# EAGLE design TPS_v1 (EAGLE 9.2.2)

## Sheet 1 of 3
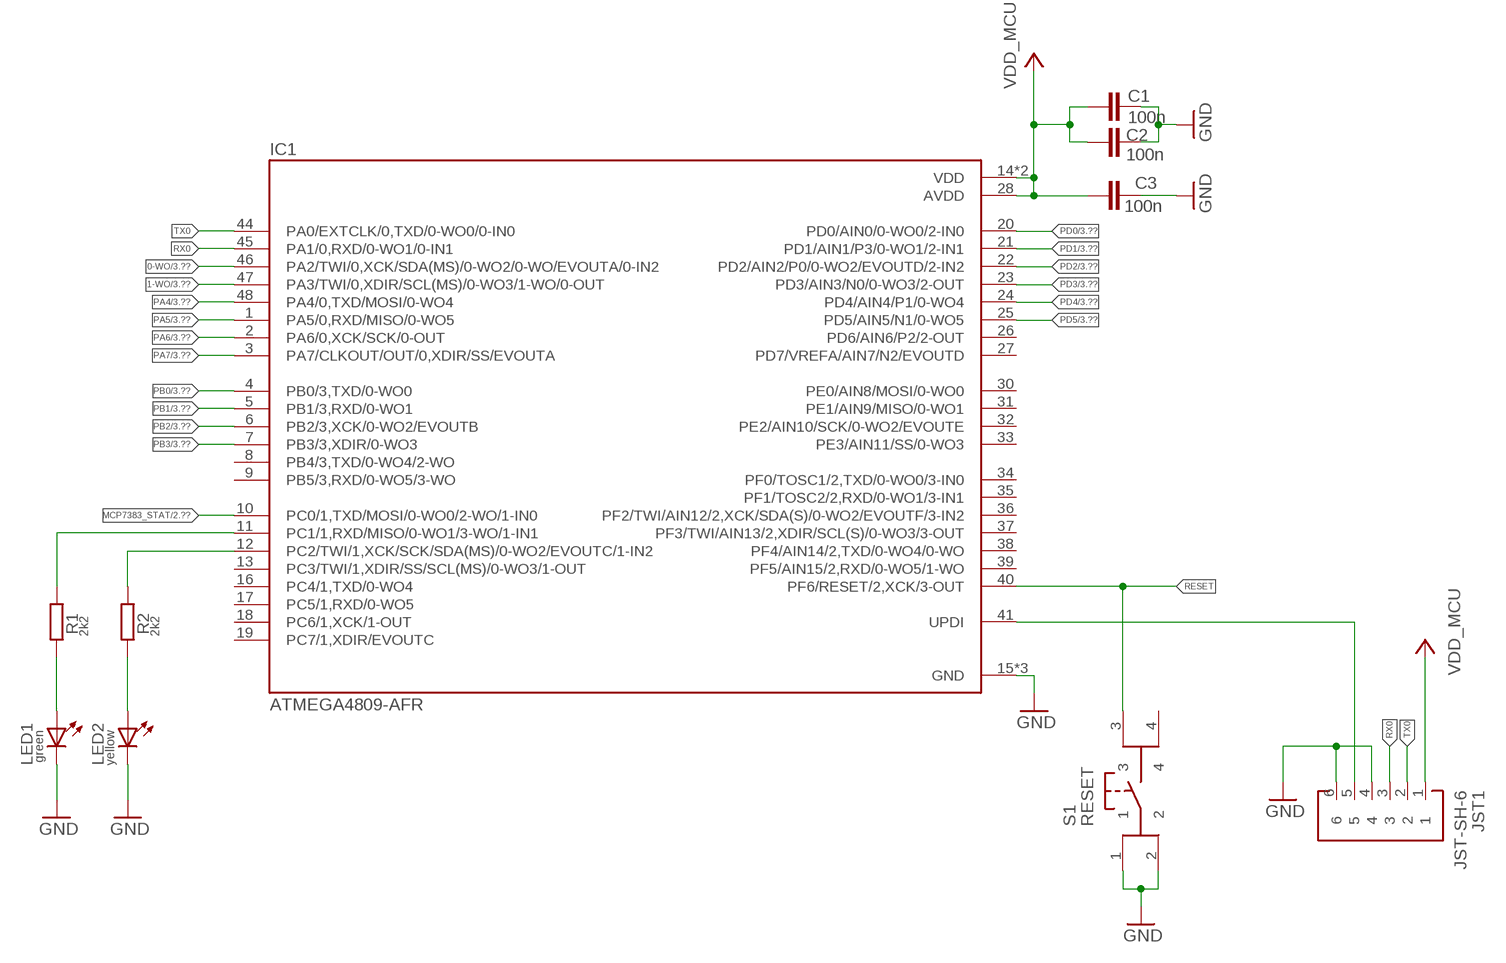
[diagram p0: schematic, sheet 1]

### Parts
C1  100n  CAPACITORC0603  [C0603]
C2  100n  CAPACITORC0603  [C0603]
C3  100n  CAPACITORC0603  [C0603]
IC1  ATMEGA4809-AFR  [QFP50P900X900X120-48N]
JST1  JST-SH-6  [JST-SH-6]
LED1  green  LED0603  [LED_0603]
LED2  yellow  LED0603  [LED_0603]
R1  2k2  RESISTOR  [R0603]
R2  2k2  RESISTOR  [R0603]
S1  RESET  BUTTON  [B3FS-1012]

### Nets
0-WO: IC1.46(PA2/TWI/0,XCK/SDA(MS)/0-WO2/0-WO/EVOUTA/0-IN2) ; also sheet 3
1-WO: IC1.47(PA3/TWI/0,XDIR/SCL(MS)/0-WO3/1-WO/0-OUT) ; also sheet 3
GND: C1.2 C2.2 C3.2 IC1.15(GND) IC1.29(GND) IC1.43(GND) JST1.4 JST1.6 LED1.C LED2.C S1.1 S1.2 ; also sheet 2,3
MCP7383_STAT: IC1.10(PC0/1,TXD/MOSI/0-WO0/2-WO/1-IN0) ; also sheet 2
N$11: LED2.A R2.1
N$13: LED1.A R1.1
N$14: IC1.12(PC2/TWI/1,XCK/SCK/SDA(MS)/0-WO2/EVOUTC/1-IN2) R2.2
N$15: IC1.11(PC1/1,RXD/MISO/0-WO1/3-WO/1-IN1) R1.2
PA4: IC1.48(PA4/0,TXD/MOSI/0-WO4) ; also sheet 3
PA5: IC1.1(PA5/0,RXD/MISO/0-WO5) ; also sheet 3
PA6: IC1.2(PA6/0,XCK/SCK/0-OUT) ; also sheet 3
PA7: IC1.3(PA7/CLKOUT/OUT/0,XDIR/SS/EVOUTA) ; also sheet 3
PB0: IC1.4(PB0/3,TXD/0-WO0) ; also sheet 3
PB1: IC1.5(PB1/3,RXD/0-WO1) ; also sheet 3
PB2: IC1.6(PB2/3,XCK/0-WO2/EVOUTB) ; also sheet 3
PB3: IC1.7(PB3/3,XDIR/0-WO3) ; also sheet 3
PD0: IC1.20(PD0/AIN0/0-WO0/2-IN0) ; also sheet 3
PD1: IC1.21(PD1/AIN1/P3/0-WO1/2-IN1) ; also sheet 3
PD2: IC1.22(PD2/AIN2/P0/0-WO2/EVOUTD/2-IN2) ; also sheet 3
PD3: IC1.23(PD3/AIN3/N0/0-WO3/2-OUT) ; also sheet 3
PD4: IC1.24(PD4/AIN4/P1/0-WO4) ; also sheet 3
PD5: IC1.25(PD5/AIN5/N1/0-WO5) ; also sheet 3
RESET: IC1.40(PF6/RESET/2,XCK/3-OUT) S1.3
RX0: IC1.45(PA1/0,RXD/0-WO1/0-IN1) JST1.3
TX0: IC1.44(PA0/EXTCLK/0,TXD/0-WO0/0-IN0) JST1.2
UPDI: IC1.41(UPDI) JST1.5
VDD_MCU: C1.1 C2.1 C3.1 IC1.14(VDD) IC1.28(AVDD) IC1.42(VDD) JST1.1 ; also sheet 2
Unconnected: IC1.8(PB4/3,TXD/0-WO4/2-WO) IC1.9(PB5/3,RXD/0-WO5/3-WO) IC1.13(PC3/TWI/1,XDIR/SS/SCL(MS)/0-WO3/1-OUT) IC1.16(PC4/1,TXD/0-WO4) IC1.17(PC5/1,RXD/0-WO5) IC1.18(PC6/1,XCK/1-OUT) IC1.19(PC7/1,XDIR/EVOUTC) IC1.26(PD6/AIN6/P2/2-OUT) IC1.27(PD7/VREFA/AIN7/N2/EVOUTD) IC1.30(PE0/AIN8/MOSI/0-WO0) IC1.31(PE1/AIN9/MISO/0-WO1) IC1.32(PE2/AIN10/SCK/0-WO2/EVOUTE) IC1.33(PE3/AIN11/SS/0-WO3) IC1.34(PF0/TOSC1/2,TXD/0-WO0/3-IN0) IC1.35(PF1/TOSC2/2,RXD/0-WO1/3-IN1) IC1.36(PF2/TWI/AIN12/2,XCK/SDA(S)/0-WO2/EVOUTF/3-IN2) IC1.37(PF3/TWI/AIN13/2,XDIR/SCL(S)/0-WO3/3-OUT) IC1.38(PF4/AIN14/2,TXD/0-WO4/0-WO) IC1.39(PF5/AIN15/2,RXD/0-WO5/1-WO) S1.4

## Sheet 2 of 3
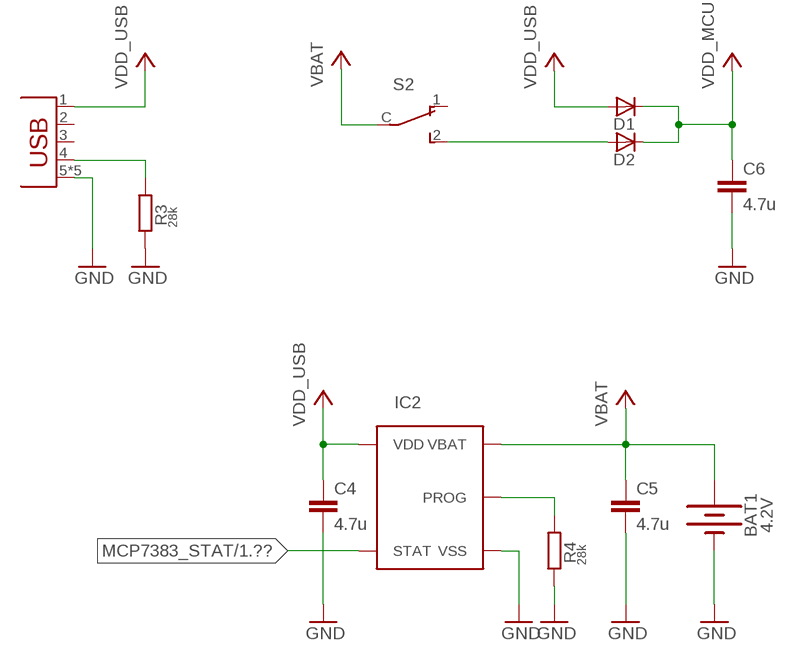
[diagram p1: schematic, sheet 2]

### Parts
BAT1  4.2V  BATTERYPAD  [CELL-CLIP_PAD_20MM]
C4  4.7u  CAPACITORC0603  [C0603]
C5  4.7u  CAPACITORC0603  [C0603]
C6  4.7u  CAPACITORC0603  [C0603]
D1  DIODE  [MBR0530T1]
D2  DIODE  [MBR0530T1]
IC2  MCP7383  [SOT23-5]
R3  28k  RESISTOR  [R0603]
R4  28k  RESISTOR  [R0603]
S2  SWITCH  [ESP40XX]
USB1  USB  [629105136821]

### Nets
GND: BAT1.- C4.2 C5.2 C6.2 IC2.2(VSS) R3.1 R4.1 USB1.5(GND) USB1.Z1(GND) USB1.Z2(GND) USB1.Z3(GND) USB1.Z4(GND) ; also sheet 1,3
MCP7383_STAT: IC2.1(STAT) ; also sheet 1
N$6: R3.2 USB1.4(USBID)
N$10: D2.P$1(A) S2.2
N$12: IC2.5(PROG) R4.2
VBAT: BAT1.+1(+) BAT1.+2(+) C5.1 IC2.3(VBAT) S2.C
VDD_MCU: C6.1 D1.P$2(C) D2.P$2(C) ; also sheet 1
VDD_USB: C4.1 D1.P$1(A) IC2.4(VDD) USB1.1(VBUS)
Unconnected: S2.1 USB1.2(D-) USB1.3(D+)

## Sheet 3 of 3
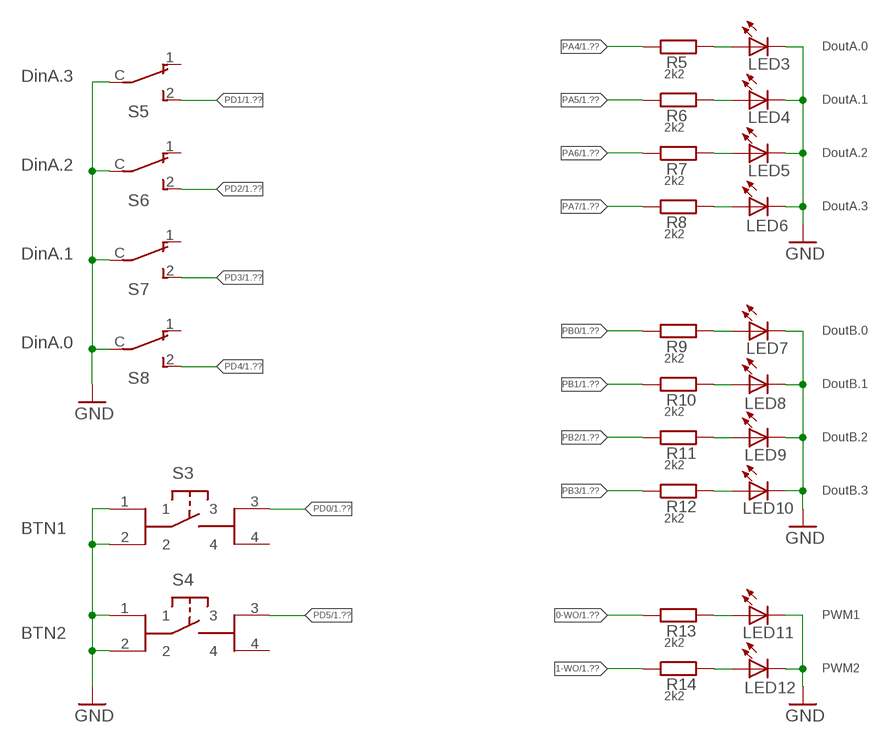
[diagram p2: schematic, sheet 3]

### Parts
LED3  DoutA.0  LED  [LED_1206]
LED4  DoutA.1  LED  [LED_1206]
LED5  DoutA.2  LED  [LED_1206]
LED6  DoutA.3  LED  [LED_1206]
LED7  DoutB.0  LED  [LED_1206]
LED8  DoutB.1  LED  [LED_1206]
LED9  DoutB.2  LED  [LED_1206]
LED10  DoutB.3  LED  [LED_1206]
LED11  PWM1  LED  [LED_1206]
LED12  PWM2  LED  [LED_1206]
R5  2k2  RESISTOR  [R0603]
R6  2k2  RESISTOR  [R0603]
R7  2k2  RESISTOR  [R0603]
R8  2k2  RESISTOR  [R0603]
R9  2k2  RESISTOR  [R0603]
R10  2k2  RESISTOR  [R0603]
R11  2k2  RESISTOR  [R0603]
R12  2k2  RESISTOR  [R0603]
R13  2k2  RESISTOR  [R0603]
R14  2k2  RESISTOR  [R0603]
S3  BTN1  BUTTON  [B3FS-1012]
S4  BTN2  BUTTON  [B3FS-1012]
S5  DinA.3  SWITCH  [ESP40XX]
S6  DinA.2  SWITCH  [ESP40XX]
S7  DinA.1  SWITCH  [ESP40XX]
S8  DinA.0  SWITCH  [ESP40XX]

### Nets
0-WO: R13.1 ; also sheet 1
1-WO: R14.1 ; also sheet 1
GND: LED3.C LED4.C LED5.C LED6.C LED7.C LED8.C LED9.C LED10.C LED11.C LED12.C S3.1 S3.2 S4.1 S4.2 S5.C S6.C S7.C S8.C ; also sheet 1,2
N$21: LED3.A R5.2
N$22: LED4.A R6.2
N$23: LED5.A R7.2
N$24: LED6.A R8.2
N$25: LED7.A R9.2
N$26: LED8.A R10.2
N$27: LED9.A R11.2
N$28: LED10.A R12.2
N$29: LED11.A R13.2
N$30: LED12.A R14.2
PA4: R5.1 ; also sheet 1
PA5: R6.1 ; also sheet 1
PA6: R7.1 ; also sheet 1
PA7: R8.1 ; also sheet 1
PB0: R9.1 ; also sheet 1
PB1: R10.1 ; also sheet 1
PB2: R11.1 ; also sheet 1
PB3: R12.1 ; also sheet 1
PD0: S3.3 ; also sheet 1
PD1: S5.2 ; also sheet 1
PD2: S6.2 ; also sheet 1
PD3: S7.2 ; also sheet 1
PD4: S8.2 ; also sheet 1
PD5: S4.3 ; also sheet 1
Unconnected: S3.4 S4.4 S5.1 S6.1 S7.1 S8.1

## Library data of the parts
BAT1 = TPS_PROJECT:BATTERY: Battery - Single Cell A variety of battery chemistries, sizes, and footprints. Device List: 20MM_PTH - Coin Cell Battery Holder - 20mm (PTH) <https://www.sparkfun.com/products/783> 20MM_PTH_KIT- Coin Cell battery Holder - 20 mm (PTH) <http://www.sparkfun.com/products/783>kit version with special mask 6.8MM_PTH - Coin Cell Battery Holder - 6.8MM(SMD) <https://www.digikey.com/product-detail/en/seiko-instruments/MS621FE-FL11E/728-1057-ND/1889208?WT.srch=1&gclid=CNOQ5a6LzdQCFZS2wAodXCkE0g> 12MM_SMD - Coin Cell Battery Holder - 12mm (SMD) <https://www.sparkfun.com/products/10592> 12MM_PTH - Coin Cell Battery Holder - 12mm (PTH) <https://www.sparkfun.com/products/7948> 20MM_SMD - 20mm Coin Cell Battery Holder (SMD) (2 legs) Used on the Big Time Watch Kit <https://www.sparkfun.com/products/11734> 20MM_SMD_4LEGS - Coin Cell Battery Holder - 20mm (SMD) <https://www.sparkfun.com/products/11892> 20MM_SMD_4LEGS_OVERPASTE - Coin Cell Battery Holder - 20mm (SMD) <https://www.sparkfun.com/products/11892> (Over-paste on the legs) 24.5MM_PTH - Coin Cell Battery Holder - 24.5mm (PTH) <https://www.sparkfun.com/products/8863> 9V - 9V Battery Holder - PC Mount Used on the SparkFun SparkPunk Sound Kit <https://www.sparkfun.com/products/11177> and SparkFun SparkPunk Sequencer Kit <https://www.sparkfun.com/products/12707> 18650 - Battery Holder - 18650 (PTH) <https://www.sparkfun.com/products/13113> AA - Battery Holder - 1xAA (PTH) <https://www.sparkfun.com/products/7949> AAA - Battery Holder - 1xAAA (PTH) <https://www.sparkfun.com/products/12718> AA_KIT - Battery Holder - 1xAA (PTH) <https://www.sparkfun.com/products/7949> Special kit package - pads only have exposed copper on one side of the board. AAA_KIT - Battery Holder - 1xAAA (PTH) <https://www.sparkfun.com/products/12718> Special kit package - pads only have exposed copper on one side of the board.
C1-C6 = TPS_PROJECT:CAPACITOR
D1 D2 = TPS_PROJECT:DIODE
IC1 = TPS_PROJECT:ATMEGA4809-AFR: 20MHz 48KB TQFP48 Ind 125C Green T&R; AVAILABILITY: Unavailable; DESCRIPTION: 20MHz 48KB TQFP48 Ind 125C Green T&R; MF: Microchip; MP: ATMEGA4809-AFR; PACKAGE: TQFP-48 Microchip; PRICE: None
IC2 = TPS_PROJECT:MCP7383
JST1 = TPS_PROJECT:JST-SH-6: connector,multipole PCB use,SM06B-SRSS-T JST SH Series, 1mm Pitch 6 Way 1 Row Right Angle PCB Header, Solder Termination, 1A Source: Datasheet <http://uk.rs-online.com/web/p/products/5468827>; DESCRIPTION: connector,multipole PCB use,SM06B-SRSS-T JST SH Series, 1mm Pitch 6 Way 1 Row Right Angle PCB Header, Solder Termination, 1A; HEIGHT: mm; MANUFACTURER_NAME: JST (JAPAN SOLDERLESS TERMINALS); MANUFACTURER_PART_NUMBER: SM06B-SRSS-TB (LF)(SN); RS_PART_NUMBER: 5468827
LED1-LED12 = TPS_PROJECT:LED
R1-R14 = TPS_PROJECT:RESISTOR
S1 S3 S4 = TPS_PROJECT:BUTTON: Plunger Tactile Switch, SPST-NO 0.05 A@ 24 V dc 1.7mm Source: Datasheet <http://uk.rs-online.com/web/p/products/6821260P>; DESCRIPTION: Plunger Tactile Switch, SPST-NO 0.05 A@ 24 V dc 1.7mm; HEIGHT: 4.3mm; MANUFACTURER_NAME: Omron Electronics; MANUFACTURER_PART_NUMBER: B3FS-1012; RS_PART_NUMBER: 6821260P; RS_PRICE-STOCK: https://www.digikey.co.uk/product-detail/en/omron-electronics-inc-emc-div/B3FS-1012/SW1082-NDL/2514802
S2 S5-S8 = TPS_PROJECT:SWITCH
USB1 = TPS_PROJECT:USB: This is a USB AB connector that is compatible with USB OTG. i.e. this connector can serve as a host or device

## Net classes
0 default: clearance 0.127 mm

## Board
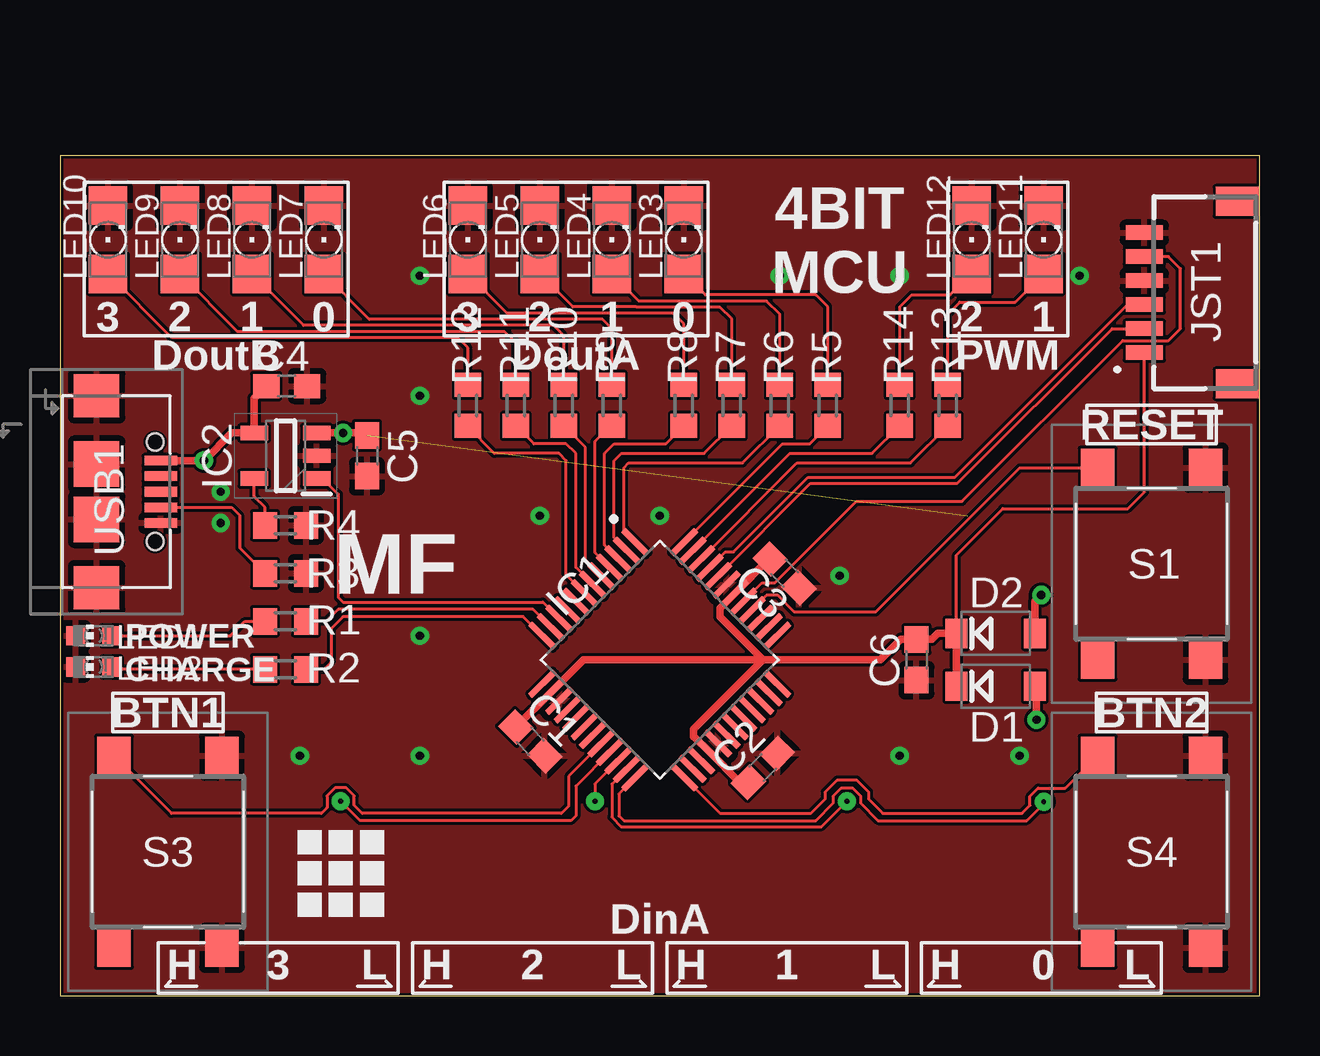
[diagram p3: board, top side]
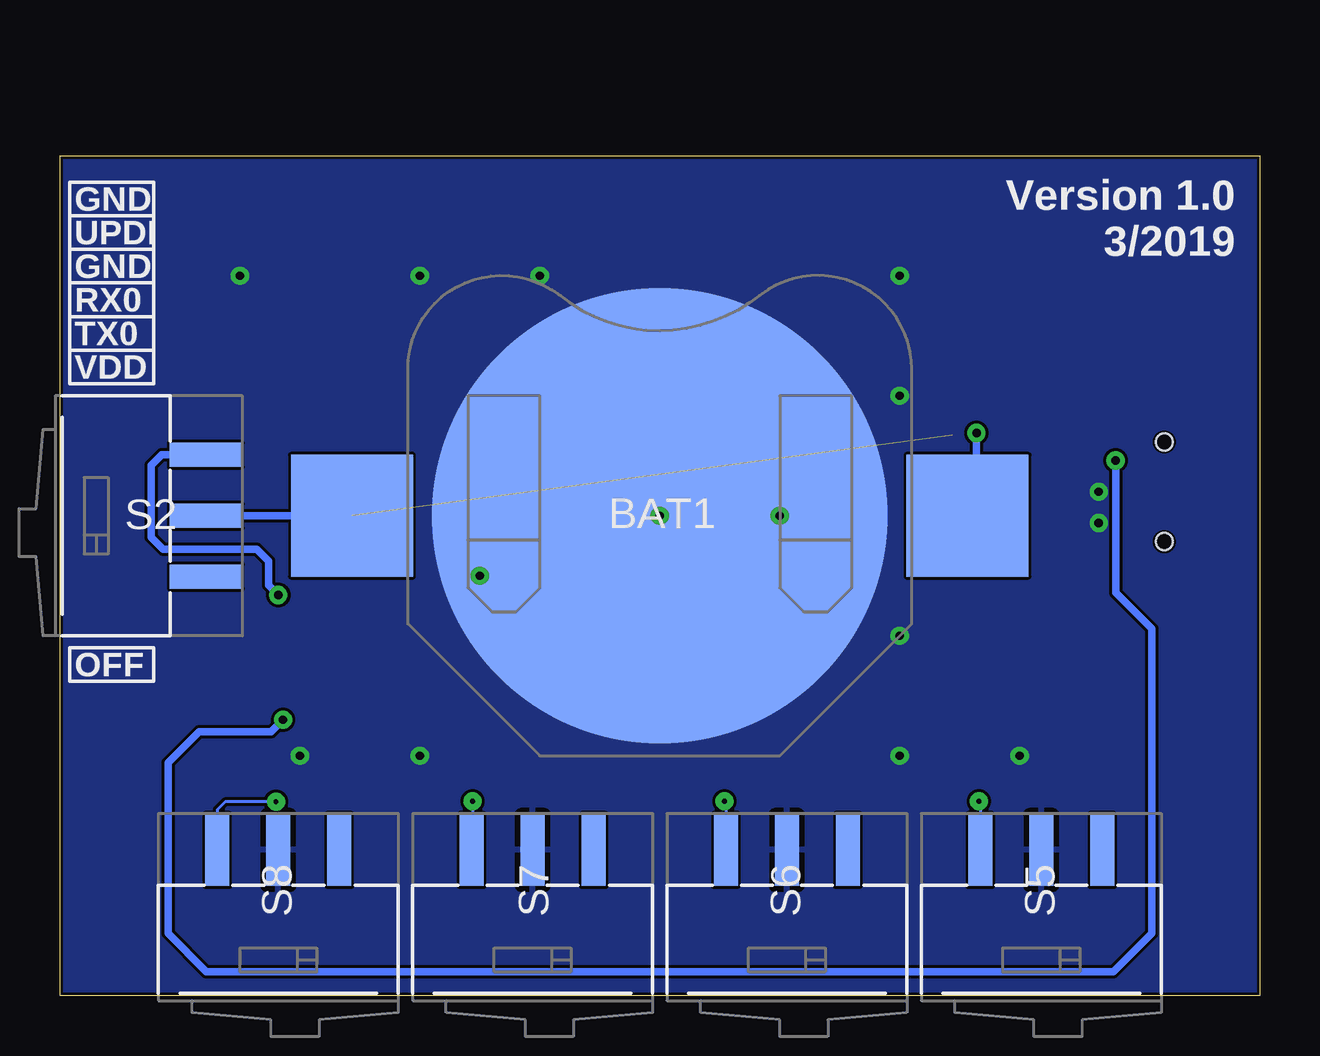
[diagram p4: board, bottom side, seen from below]

Size 50 x 35 mm. Coordinates in mm from the lower left corner, seen from the top.
Outline: 0,0 50,0 50,35 0,35 0,0
Copper layers (1*16): Top 0.035mm / dielectric 1.5mm / Bottom 0.035mm
Design rules "TPS_v1 *": minimum track width 5mil, minimum drill 0.2mm, track to track 5mil, track to pad 5mil, pad to pad 5mil, via to via 5mil, smd to smd 5mil, copper to edge 5mil, drill to drill 6mil, minimum pad ring 18mil, minimum via ring 8mil, stop-mask expansion 4mil, vias tented up to drill 0mil, thermal gap 10mil

### Footprints (pad centres in the part's own frame; a part is rotated, then mirrored left to right if it is on the bottom)
CELL-CLIP_PAD_20MM = smd 5.08 x 5.08: +1 12.83,0; +2 -12.83,0 | smd 19 x 19: - 0,0
C0603 = smd 1.1 x 1: 1 -0.85,0; 2 0.85,0
MBR0530T1 = smd 0.91 x 1.22: P$1 1.635,0; P$2 -1.635,0
QFP50P900X900X120-48N = smd 1.47 x 0.28: 1 -4.17,2.75; 2 -4.17,2.25; 3 -4.17,1.75; 4 -4.17,1.25; 5 -4.17,0.75; 6 -4.17,0.25; 7 -4.17,-0.25; 8 -4.17,-0.75; 9 -4.17,-1.25; 10 -4.17,-1.75; 11 -4.17,-2.25; 12 -4.17,-2.75; 25 4.17,-2.75; 26 4.17,-2.25; 27 4.17,-1.75; 28 4.17,-1.25; 29 4.17,-0.75; 30 4.17,-0.25; 31 4.17,0.25; 32 4.17,0.75; 33 4.17,1.25; 34 4.17,1.75; 35 4.17,2.25; 36 4.17,2.75 | smd 0.28 x 1.47: 13 -2.75,-4.17; 14 -2.25,-4.17; 15 -1.75,-4.17; 16 -1.25,-4.17; 17 -0.75,-4.17; 18 -0.25,-4.17; 19 0.25,-4.17; 20 0.75,-4.17; 21 1.25,-4.17; 22 1.75,-4.17; 23 2.25,-4.17; 24 2.75,-4.17; 37 2.75,4.17; 38 2.25,4.17; 39 1.75,4.17; 40 1.25,4.17; 41 0.75,4.17; 42 0.25,4.17; 43 -0.25,4.17; 44 -0.75,4.17; 45 -1.25,4.17; 46 -1.75,4.17; 47 -2.25,4.17; 48 -2.75,4.17
SOT23-5 = smd 1.15 x 0.6: 1 -1.3,0.95; 2 -1.3,0; 3 -1.3,-0.95; 4 1.3,-0.95; 5 1.3,0.95
JST-SH-6 = smd 0.6 x 1.55: 1 -2.5,0.4; 2 -1.5,0.4; 3 -0.5,0.4; 4 0.5,0.4; 5 1.5,0.4; 6 2.5,0.4 | smd 1.2 x 1.8: 7 3.8,-3.475; 8 -3.8,-3.475
LED_0603 = smd 0.8 x 0.8: A 0,-0.75; C 0,0.75
LED_1206 = smd 1.6 x 1.6: A -1.422,0; C 1.422,0
R0603 = smd 1 x 1.1: 1 -0.85,0; 2 0.85,0
B3FS-1012 = smd 1.6 x 1.4: 1 4,-2.25; 2 -4,-2.25; 3 4,2.25; 4 -4,2.25
ESP40XX = smd 3 x 1: 1 3.08,-2.54; 2 3.08,2.54; C 3.08,0
629105136821 = smd 0.4 x 1.35: 1 -1.3,0; 2 -0.65,0; 3 0,0; 4 0.65,0; 5 1.3,0 | smd 1.8 x 1.9: Z1 -4,-2.675; Z4 4,-2.675 | smd 1.9 x 1.9: Z2 -1.15,-2.675; Z3 1.15,-2.675 | hole 0.7: -2.075,-0.225; 2.075,-0.225

### Placement (x,y rotation side)
BAT1  25,20 0 bottom
C1  19.6,10.6 315 top
C2  29.3,9.5 45 top
C3  30.2,17.6 315 top
C4  9.45,25.4 0 top
C5  12.8,22.5 270 top
C6  35.7,14 270 top
D1  39,12.9 0 top
D2  39,15.1 0 top
IC1  25,14 315 top
IC2  9.4,22.5 180 top
JST1  45.6,29.3 90 top
LED1  1.4,15 90 top
LED2  1.4,13.7 90 top
LED3  26,31.5 90 top
LED4  23,31.5 90 top
LED5  20,31.5 90 top
LED6  17,31.5 90 top
LED7  11,31.5 90 top
LED8  8,31.5 90 top
LED9  5,31.5 90 top
LED10  2,31.5 90 top
LED11  41,31.5 90 top
LED12  38,31.5 90 top
R1  9.4,15.6 0 top
R2  9.4,13.6 0 top
R3  9.4,17.6 180 top
R4  9.4,19.6 180 top
R5  32,24.6 90 top
R6  30,24.6 90 top
R7  28,24.6 90 top
R8  26,24.6 90 top
R9  23,24.6 90 top
R10  21,24.6 90 top
R11  19,24.6 90 top
R12  17,24.6 90 top
R13  37,24.6 90 top
R14  35,24.6 90 top
S1  45.5,18 90 top
S2  47,20 0 bottom
S3  4.5,6 90 top
S4  45.5,6 90 top
S5  9.1,3 90 bottom
S6  19.7,3 90 bottom
S7  30.3,3 90 bottom
S8  40.9,3 90 bottom
USB1  4.2,21 270 top

### Tracks (layer width: path | path; a pad name or v marks a point on that pad's centre or on a via)
0-WO
  Top 0.127: IC1.46 30.73,22.2 35.45,22.2 R13.1
1-WO
  Top 0.127: IC1.47 30.42,22.6 33.85,22.6 R14.1
GND  (via drill 0.35 pad 0.75)
  other vias: 6.7,19.7 6.7,21 25,20 10,10 15,10 35,10 40,10 15,15 20,20 15,25 15,30 30,30 35,30 42.5,30 32.5,17.5
  pour Top: -1,-1 51,-1 51,38 -1,38
  pour Bottom: -1,36 -1,-3 51,-3 51,36
MCP7383_STAT
  Top 0.127: IC2.1 10.95,21.55 11.6,20.9 11.6,16.6 11.8,16.4 20.12,16.4 IC1.10
N$6
  Top 0.127: R3.2 7.5,18.65 7.5,20 7.15,20.35 USB1.4
N$10  (via drill 0.35 pad 0.75)
  Top 0.305: v40.9,16.7 40.63,16.43 D2.P$1
  Bottom 0.305: S2.2 45.76,22.54 46.2,22.1 46.2,19.1 45.7,18.6 41.8,18.6 41.3,18.1 41.3,17.1 v40.9,16.7
N$11
  Top 0.127: R2.1 2.25,13.6 LED2.A
N$12
  Top 0.127: R4.2 8.55,20.35 8.1,20.8 IC2.5
N$13
  Top 0.127: LED1.A 7.1,15 7.7,15.6 R1.1
N$14
  Top 0.127: IC1.12 19.31,15.8 11.8,15.8 11.3,15.3 11.3,13.9 11,13.6 R2.2
N$15
  Top 0.127: R1.2 11.1,15.6 11.6,16.1 19.72,16.1 IC1.11
N$21
  Top 0.127: LED3.A 26.02,30.08 26.9,29.2 31.5,29.2 32,28.7 R5.2
N$22
  Top 0.127: R6.2 30,27 30,27.09 30,28.4 29.45,28.95 24.13,28.95 LED4.A
N$23
  Top 0.127: R7.2 28,28.2 27.51,28.69 24.03,28.69 24.02,28.7 21.38,28.7 LED5.A
N$24
  Top 0.127: R8.2 26,28 25.56,28.44 18.64,28.44 LED6.A
N$25
  Top 0.127: LED7.A 12.89,28.18 22.62,28.18 23,27.8 R9.2
N$26
  Top 0.127: LED8.A 10.15,27.93 20.57,27.93 21,27.5 R10.2
N$27
  Top 0.127: R11.2 19,27.2 18.52,27.68 7.4,27.68 LED9.A
N$28
  Top 0.127: LED10.A 4.66,27.42 16.58,27.42 17,27 R12.2
N$29
  Top 0.127: LED11.A 39.82,28.9 37.5,28.9 37,28.4 R13.2
N$30
  Top 0.127: R14.2 35,28.7 35.5,29.2 37.1,29.2 37.98,30.08 LED12.A
PA4
  Top 0.127: IC1.48 30.11,23 31.25,23 R5.1
PA5
  Top 0.127: IC1.1 23.5,19.39 23.5,22 23.7,22.2 28.45,22.2 R6.1
PA6
  Top 0.127: IC1.2 23.1,19.08 23.1,22.3 23.4,22.6 26.85,22.6 R7.1
PA7
  Top 0.127: IC1.3 22.7,18.77 22.7,22.6 23.1,23 25.25,23 R8.1
PB0
  Top 0.127: IC1.4 22.3,18.47 22.3,23.1 22.95,23.75 R9.1
PB1
  Top 0.127: IC1.5 21.9,18.16 21.9,22.85 R10.1
PB2
  Top 0.127: IC1.6 21.5,17.85 21.5,22.6 21.1,23 19.75,23 R11.1
PB3
  Top 0.127: IC1.7 21.1,17.55 21.1,22.3 20.8,22.6 18.1,22.6 17,23.7 R12.1
PD0
  Top 0.127: IC1.20 21.2,9.14 21.2,7.9 20.9,7.6 12.6,7.6 12.27,7.93 12.27,8.33 11.93,8.66 11.47,8.66 11.13,8.33 11.13,7.83 10.9,7.6 4.65,7.6 S3.3
PD1  (via drill 0.2 pad 0.75)
  Top 0.127: IC1.21 21.5,8.73 21.5,7.5 21.3,7.3 12.5,7.3 v11.7,8.1
  Bottom 0.127: v11.7,8.1 11.64,8.04 S5.2
PD2  (via drill 0.2 pad 0.75)
  Top 0.127: IC1.22 22.3,8.82 v22.3,8.1
  Bottom 0.127: v22.3,8.1 22.24,8.04 S6.2
PD3  (via drill 0.2 pad 0.75)
  Top 0.127: IC1.23 23,8.82 23,7.44 23.39,7.05 31.75,7.05 v32.8,8.1
  Bottom 0.127: v32.8,8.1 32.8,6.12 S7.2
PD4  (via drill 0.2 pad 0.75)
  Top 0.127: IC1.24 23.3,8.41 23.3,7.5 23.5,7.3 31.5,7.3 32.23,8.03 32.23,8.33 32.57,8.66 33.03,8.66 33.37,8.33 33.37,8.03 34.1,7.3 40.3,7.3 41,8 v41,8.08
  Bottom 0.127: v41,8.08 43.12,8.08 43.44,7.76 S8.2
PD5
  Top 0.127: IC1.25 27.51,7.6 31.3,7.6 31.9,8.2 31.9,8.5 32.4,9 33.2,9 33.7,8.5 33.7,8.2 34.3,7.6 40.1,7.6 40.43,7.93 40.43,8.32 40.77,8.65 41.9,8.65 S4.3
RESET
  Top 0.127: IC1.40 29.47,16.7 29.9,16.7 30.6,16 34,16 40,22 S1.3
RX0
  Top 0.127: IC1.45 27.73,18.5 28.08,18.5 31.18,21.6 37.3,21.6 44.5,28.8 JST1.3
TX0
  Top 0.127: JST1.2 43.86,27.8 37.41,21.35 31.29,21.35 IC1.44
UPDI
  Top 0.127: IC1.41 29.26,17.2 29.8,17.2 33.2,20.6 37.6,20.6 44.3,27.3 46.2,27.3 46.7,27.8 46.7,30.3 46.2,30.8 JST1.5
VBAT  (via drill 0.35 pad 0.75)  (1 unrouted)
  Top 0.305: IC2.3 v11.8,23.45 12.7,23.45 C5.1
  Bottom 0.305: BAT1.+1 11.8,20.37 v11.8,23.45 | BAT1.+2 S2.C
VDD_MCU
  Top 0.127: D2.P$2 37.37,18.36 39.3,20.3 44.52,20.3 45.2,20.98 JST1.1
  Top 0.305: D1.P$2 D2.P$2 36.6,15.1 36.35,14.85 C6.1 35.05,14.85 34.2,14 29.3,14 | 29.3,14 27.5,15.8 27.5,16.15 IC1.42 29.55,18.2 C3.1 | 29.3,14 26.4,11.1 26.4,10.8 26.43,10.8 IC1.28 28.33,8.9 C2.1 | 29.3,14 21.82,14 IC1.14 19.02,11.2 C1.1
VDD_USB  (via drill 0.35 pad 0.75)
  Top 0.305: C4.1 8.1,24.9 IC2.4 7.15,23.45 v6,22.3 USB1.1 | v40.7,11.5 40.7,12.84 D1.P$1
  Bottom 0.305: v6,22.3 6,16.8 4.5,15.3 4.5,2.6 6.1,1 43.9,1 45.5,2.6 45.5,9.7 44.2,11 41.2,11 v40.7,11.5

### Text on the board
tPlace: 4BIT / MCU | 3 | 2 | 1 | 0 | 3 | 2 | 1 | 0 | 2 | 1 | DoutB | DoutA | PWM | RESET | MF | POWER | CHARGE | BTN1 | BTN2 | DinA | H | 3 | L | H | 2 | L | H | 1 | L | H | 0 | L
bPlace: Version 1.0 / 3/2019 | GND | UPDI | GND | RX0 | TX0 | VDD | OFF